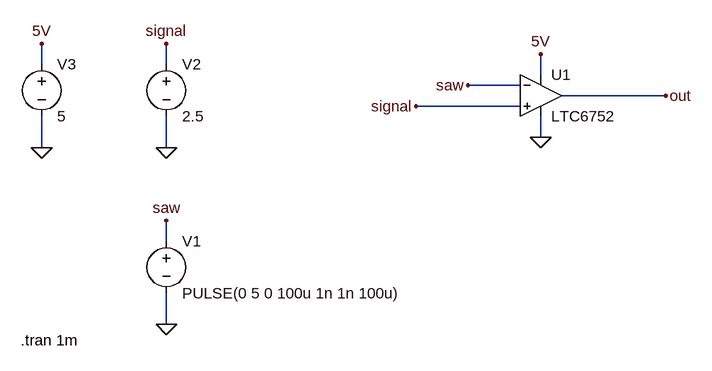
[diagram p0: schematic pwm.asc]
pwm.asc, the LTspice schematic file:
Version 4
SHEET 1 880 680
WIRE -304 -64 -304 -96
WIRE -112 -64 -112 -96
WIRE 464 -48 464 -80
WIRE 432 -32 352 -32
WIRE 656 -16 496 -16
WIRE 432 0 272 0
WIRE 464 48 464 16
WIRE -304 64 -304 16
WIRE -112 64 -112 16
WIRE -112 208 -112 176
WIRE -112 336 -112 288
FLAG -112 336 0
FLAG -112 176 saw
FLAG -112 -96 signal
FLAG -304 -96 5V
FLAG -112 64 0
FLAG -304 64 0
FLAG 464 48 0
FLAG 464 -80 5V
FLAG 656 -16 out
FLAG 272 0 signal
FLAG 352 -32 saw
SYMBOL voltage -112 192 R0
WINDOW 123 0 0 Left 0
WINDOW 39 0 0 Left 0
SYMATTR InstName V1
SYMATTR Value PULSE(0 5 0 100u 1n 1n 100u)
SYMBOL voltage -112 -80 R0
WINDOW 123 0 0 Left 0
WINDOW 39 0 0 Left 0
SYMATTR InstName V2
SYMATTR Value 2.5
SYMBOL voltage -304 -80 R0
WINDOW 123 0 0 Left 0
WINDOW 39 0 0 Left 0
SYMATTR InstName V3
SYMATTR Value 5
SYMBOL Comparators\\LTC6752 464 -80 R0
SYMATTR InstName U1
TEXT -336 360 Left 2 !.tran 1m

The netlist it stands for:
* pwm.asc
V1 saw 0 PULSE(0 5 0 100u 1n 1n 100u)
V2 signal 0 2.5
V3 5V 0 5
XU1 signal saw 5V 0 out LTC6752  ; pins In+ In- V+ V- OUT
.tran 1m
.lib LTC7.lib
.backanno
.end